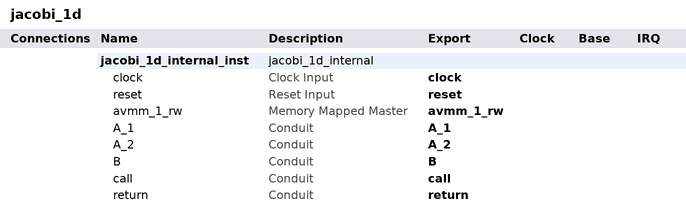
[diagram p0: system contents]
# Platform Designer (Qsys) system jacobi_1d, Cyclone V 5CSEMA4U23C7
# Parameters at their usual value, and those the tool derives, are not listed.
package require qsys
create_system jacobi_1d
set_project_property DEVICE_FAMILY {Cyclone V}
set_project_property DEVICE 5CSEMA4U23C7

add_instance jacobi_1d_internal_inst jacobi_1d_internal 1.0
set_instance_property jacobi_1d_internal_inst AUTO_EXPORT true

# exported interfaces
add_interface A_1 conduit end
set_interface_property A_1 EXPORT_OF jacobi_1d_internal_inst.A_1
add_interface A_2 conduit end
set_interface_property A_2 EXPORT_OF jacobi_1d_internal_inst.A_2
add_interface B conduit end
set_interface_property B EXPORT_OF jacobi_1d_internal_inst.B
add_interface avmm_1_rw avalon master
set_interface_property avmm_1_rw EXPORT_OF jacobi_1d_internal_inst.avmm_1_rw
add_interface call conduit end
set_interface_property call EXPORT_OF jacobi_1d_internal_inst.call
add_interface clock clock sink
set_interface_property clock EXPORT_OF jacobi_1d_internal_inst.clock
add_interface reset reset sink
set_interface_property reset EXPORT_OF jacobi_1d_internal_inst.reset
add_interface return conduit end
set_interface_property return EXPORT_OF jacobi_1d_internal_inst.return

set_interconnect_requirement {$system} qsys_mm.clockCrossingAdapter HANDSHAKE
set_interconnect_requirement {$system} qsys_mm.enableEccProtection FALSE
set_interconnect_requirement {$system} qsys_mm.insertDefaultSlave FALSE
set_interconnect_requirement {$system} qsys_mm.maxAdditionalLatency 1

save_system jacobi_1d.qsys
